# Altium schematic sheet Smart_energy_meter.SchDoc
size A3; Author: Darijo Topic dipl.ing.; DrawnBy: Darijo Topic dipl.ing.; ProjectName: Smart energy meter
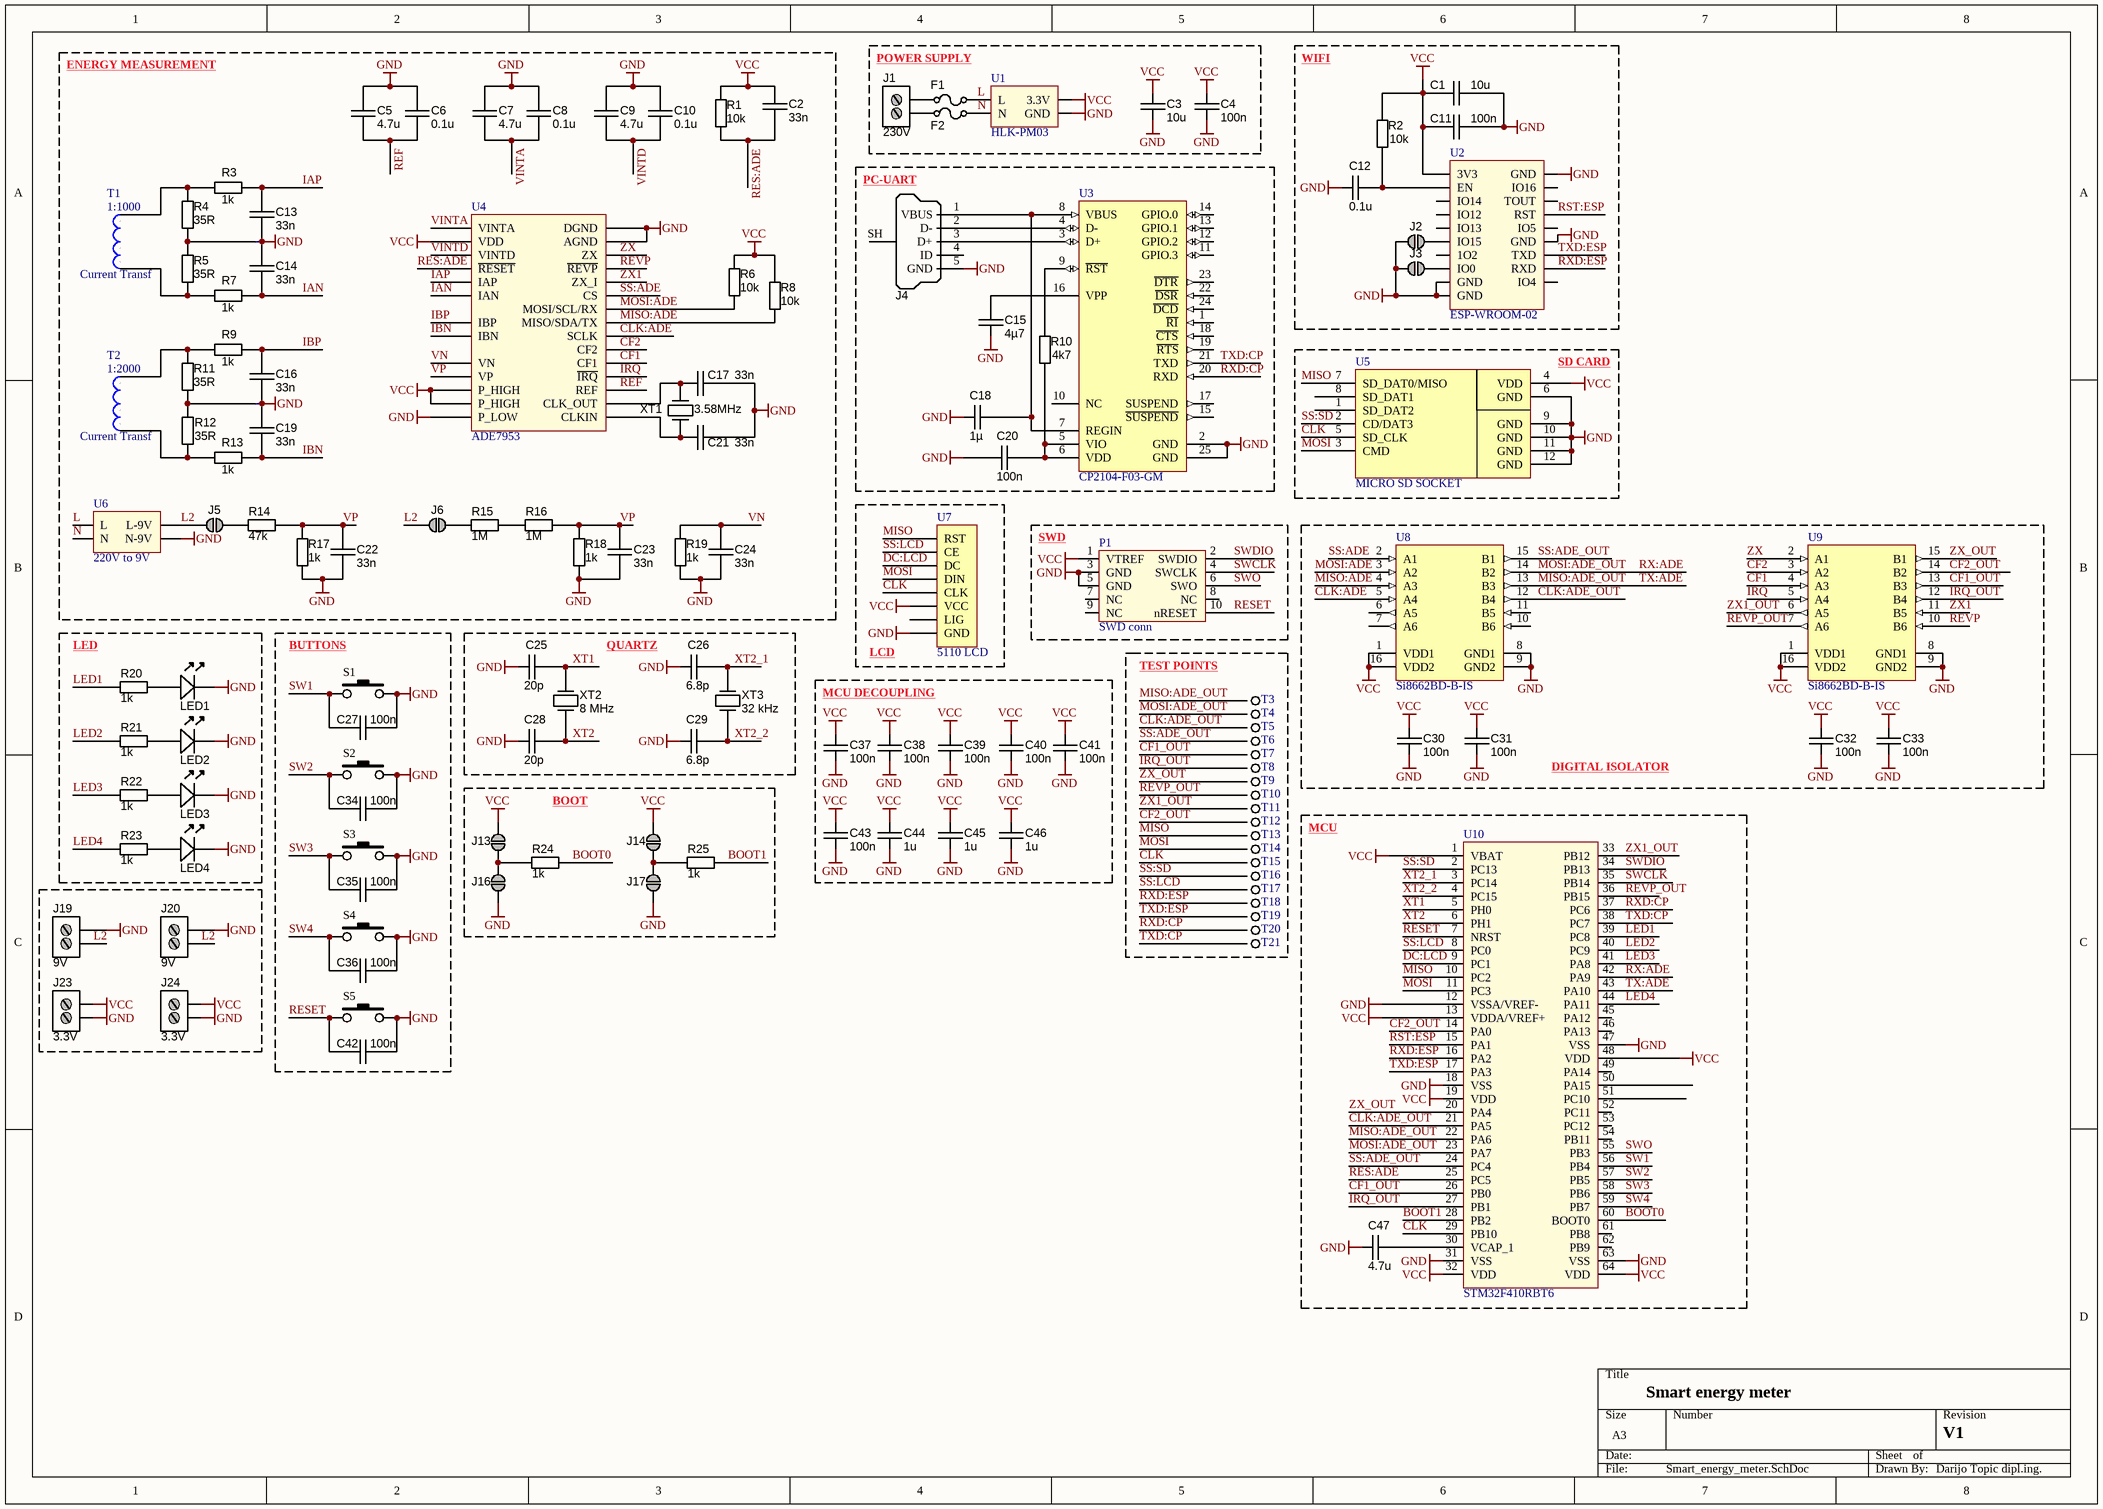
[diagram p0: Smart_energy_meter.SchDoc]

## Parts
C1  value 10u  [CAPC2012X135N]  (hidden comment: approved sub OK)
C2  value 33n  [CAPC2012X135N]  (hidden comment: approved sub OK)
C3  value 10u  [CAPC2012X135N]  (hidden comment: approved sub OK)
C4  value 100n  [CAPC2012X135N]  (hidden comment: approved sub OK)
C5  value 4.7u  [CAPC2012X135N]  (hidden comment: approved sub OK)
C6  value 0.1u  [CAPC2012X135N]  (hidden comment: approved sub OK)
C7  value 4.7u  [CAPC2012X135N]  (hidden comment: approved sub OK)
C8  value 0.1u  [CAPC2012X135N]  (hidden comment: approved sub OK)
C9  value 4.7u  [CAPC2012X135N]  (hidden comment: approved sub OK)
C10  value 0.1u  [CAPC2012X135N]  (hidden comment: approved sub OK)
C11  value 100n  [CAPC2012X135N]  (hidden comment: approved sub OK)
C12  value 0.1u  [CAPC2012X135N]  (hidden comment: approved sub OK)
C13  value 33n  [CAPC2012X135N]  (hidden comment: approved sub OK)
C14  value 33n  [CAPC2012X135N]  (hidden comment: approved sub OK)
C15  value 4µ7  [CAPC2012X135N]  (hidden comment: approved sub OK)
C16  value 33n  [CAPC2012X135N]  (hidden comment: approved sub OK)
C17  value 33n  [CAPC2012X135N]  (hidden comment: approved sub OK)
C18  value 1µ  [CAPC2012X135N]  (hidden comment: approved sub OK)
C19  value 33n  [CAPC2012X135N]  (hidden comment: approved sub OK)
C20  value 100n  [CAPC2012X135N]  (hidden comment: approved sub OK)
C21  value 33n  [CAPC2012X135N]  (hidden comment: approved sub OK)
C22  value 33n  [CAPC2012X135N]  (hidden comment: approved sub OK)
C23  value 33n  [CAPC2012X135N]  (hidden comment: approved sub OK)
C24  value 33n  [CAPC2012X135N]  (hidden comment: approved sub OK)
C25  value 20p  [CAPC2012X135N]  (hidden comment: approved sub OK)
C26  value 6.8p  [CAPC2012X135N]  (hidden comment: approved sub OK)
C27  value 100n  [CAPC2012X135N]  (hidden comment: approved sub OK)
C28  value 20p  [CAPC2012X135N]  (hidden comment: approved sub OK)
C29  value 6.8p  [CAPC2012X135N]  (hidden comment: approved sub OK)
C30  value 100n  [CAPC2012X135N]  (hidden comment: approved sub OK)
C31  value 100n  [CAPC2012X135N]  (hidden comment: approved sub OK)
C32  value 100n  [CAPC2012X135N]  (hidden comment: approved sub OK)
C33  value 100n  [CAPC2012X135N]  (hidden comment: approved sub OK)
C34  value 100n  [CAPC2012X135N]  (hidden comment: approved sub OK)
C35  value 100n  [CAPC2012X135N]  (hidden comment: approved sub OK)
C36  value 100n  [CAPC2012X135N]  (hidden comment: approved sub OK)
C37  value 100n  [CAPC2012X135N]  (hidden comment: approved sub OK)
C38  value 100n  [CAPC2012X135N]  (hidden comment: approved sub OK)
C39  value 100n  [CAPC2012X135N]  (hidden comment: approved sub OK)
C40  value 100n  [CAPC2012X135N]  (hidden comment: approved sub OK)
C41  value 100n  [CAPC2012X135N]  (hidden comment: approved sub OK)
C42  value 100n  [CAPC2012X135N]  (hidden comment: approved sub OK)
C43  value 100n  [CAPC2012X135N]  (hidden comment: approved sub OK)
C44  value 1u  [CAPC2012X135N]  (hidden comment: approved sub OK)
C45  value 1u  [CAPC2012X135N]  (hidden comment: approved sub OK)
C46  value 1u  [CAPC2012X135N]  (hidden comment: approved sub OK)
C47  value 4.7u  [CAPC2012X135N]  (hidden comment: approved sub OK)
F1  Slow-blow  [Fuses 20A 250VAC]  (value not drawn)
F2  Slow-blow  [Fuses 20A 250VAC]  (value not drawn)
J1  230V  [2P_PCB_ScrewTerm_90S_3.81MM]
J2  Jumper  [HDR1X2]  (value not drawn)  (no BOM)
J3  Jumper  [HDR1X2]  (value not drawn)  (no BOM)
J4  USB Micro Type B (recommended if hand soldering)  [USB_Micro-B_FCI_SMD]  (value not drawn)
J5  Jumper  [HDR1X2]  (value not drawn)  (no BOM)
J6  Jumper  [HDR1X2]  (value not drawn)  (no BOM)
J13  Jumper  [HDR1X2]  (value not drawn)  (no BOM)
J14  Jumper  [HDR1X2]  (value not drawn)  (no BOM)
J16  Jumper  [HDR1X2]  (value not drawn)  (no BOM)
J17  Jumper  [HDR1X2]  (value not drawn)  (no BOM)
J19  9V  [2P_PCB_ScrewTerm_90S_3.81MM]
J20  9V  [2P_PCB_ScrewTerm_90S_3.81MM]
J23  3.3V  [2P_PCB_ScrewTerm_90S_3.81MM]
J24  3.3V  [2P_PCB_ScrewTerm_90S_3.81MM]
LED1  (no value)  [LED-0805-K]
LED2  (no value)  [LED-0805-K]
LED3  (no value)  [LED-0805-K]
LED4  (no value)  [LED-0805-K]
P1  SWD conn  [HDR2X5_CEN]
R1  value 10k  [RESC2012X70N]  (hidden comment: Thick Film)
R2  value 10k  [RESC2012X70N]  (hidden comment: Thick Film)
R3  value 1k  [RESC2012X70N]  (hidden comment: Thick Film)
R4  value 35R  [RESC2012X70N]  (hidden comment: Thick Film)
R5  value 35R  [RESC2012X70N]  (hidden comment: Thick Film)
R6  value 10k  [RESC2012X70N]  (hidden comment: Thick Film)
R7  value 1k  [RESC2012X70N]  (hidden comment: Thick Film)
R8  value 10k  [RESC2012X70N]  (hidden comment: Thick Film)
R9  value 1k  [RESC2012X70N]  (hidden comment: Thick Film)
R10  value 4k7  [RESC2012X70N]  (hidden comment: Thick Film)
R11  value 35R  [RESC2012X70N]  (hidden comment: Thick Film)
R12  value 35R  [RESC2012X70N]  (hidden comment: Thick Film)
R13  value 1k  [RESC2012X70N]  (hidden comment: Thick Film)
R14  value 47k  [RESC2012X70N]  (hidden comment: Thick Film)
R15  value 1M  [RESC2012X70N]  (hidden comment: Thick Film)
R16  value 1M  [RESC2012X70N]  (hidden comment: Thick Film)
R17  value 1k  [RESC2012X70N]  (hidden comment: Thick Film)
R18  value 1k  [RESC2012X70N]  (hidden comment: Thick Film)
R19  value 1k  [RESC2012X70N]  (hidden comment: Thick Film)
R20  value 1k  [RESC2012X70N]  (hidden comment: Thick Film)
R21  value 1k  [RESC2012X70N]  (hidden comment: Thick Film)
R22  value 1k  [RESC2012X70N]  (hidden comment: Thick Film)
R23  value 1k  [RESC2012X70N]  (hidden comment: Thick Film)
R24  value 1k  [RESC2012X70N]  (hidden comment: Thick Film)
R25  value 1k  [RESC2012X70N]  (hidden comment: Thick Film)
S1  SMD_BUTTON  [SMD_BUTTON]  (value not drawn)
S2  SMD_BUTTON  [SMD_BUTTON]  (value not drawn)
S3  SMD_BUTTON  [SMD_BUTTON]  (value not drawn)
S4  SMD_BUTTON  [SMD_BUTTON]  (value not drawn)
S5  SMD_BUTTON  [SMD_BUTTON]  (value not drawn)
T1  Current Transf  RATIO: 1:1000  [CST-1025]
T2  Current Transf  RATIO: 1:2000  [DL-CT1005A]
T3  Test Point  [PIN1]  (value not drawn)
T4  Test Point  [PIN1]  (value not drawn)
T5  Test Point  [PIN1]  (value not drawn)
T6  Test Point  [PIN1]  (value not drawn)
T7  Test Point  [PIN1]  (value not drawn)
T8  Test Point  [PIN1]  (value not drawn)
T9  Test Point  [PIN1]  (value not drawn)
T10  Test Point  [PIN1]  (value not drawn)
T11  Test Point  [PIN1]  (value not drawn)
T12  Test Point  [PIN1]  (value not drawn)
T13  Test Point  [PIN1]  (value not drawn)
T14  Test Point  [PIN1]  (value not drawn)
T15  Test Point  [PIN1]  (value not drawn)
T16  Test Point  [PIN1]  (value not drawn)
T17  Test Point  [PIN1]  (value not drawn)
T18  Test Point  [PIN1]  (value not drawn)
T19  Test Point  [PIN1]  (value not drawn)
T20  Test Point  [PIN1]  (value not drawn)
T21  Test Point  [PIN1]  (value not drawn)
U1  HLK-PM03  [HLK-PM03]
U2  ESP-WROOM-02  [ESP-WROOM-02]
U3  CP2104-F03-GM  [SLAB-QFN-24-2675x2675TP_N]
U4  ADE7953  [CP_28_6]
U5  MICRO SD SOCKET  [SDSOCKET_MOLEX]
U6  220V to 9V  [TRAFO 220-9]
U7  5110 LCD  [HDR1X8]
U8  Si8662BD-B-IS  [SLAB-SOIC-16-WB_N]
U9  Si8662BD-B-IS  [SLAB-SOIC-16-WB_N]
U10  STM32F410RBT6  [STM-LQFP64_L]
XT1  3.58MHz  [CRYSTAL_HC49-US-SM]
XT2  8 MHz  [CRYSTAL_HC49-US-SM]
XT3  32 kHz  [85SMX]

## Blocks framed on the sheet
ENERGY MEASUREMENT: C2 C5-C10 C13 C14 C16 C17 C19 C21-C24 J5 J6 R1 R3-R9 R11-R19 T1 T2 U4 U6 XT1
POWER SUPPLY: C3 C4 F1 F2 J1 U1
WIFI: C1 C11 C12 J2 J3 R2 U2
PC-UART: C15 C18 C20 J4 R10 U3
SD CARD: U5
LCD: U7
SWD: P1
DIGITAL ISOLATOR: C30-C33 U8 U9
LED: LED1-LED4 R20-R23
BUTTONS: C27 C34-C36 C42 S1-S5
QUARTZ: C25 C26 C28 C29 XT2 XT3
TEST POINTS: T3-T21
MCU DECOUPLING: C37-C41 C43-C46
BOOT: J13 J14 J16 J17 R24 R25
MCU: C47 U10

## Nets
GND: C1.1 C3.2 C4.2 C5.2 C6.2 C7.2 C8.2 C9.2 C10.2 C11.1 C12.2 C13.1 C14.2 C15.2 C16.1 C17.1 C18.1 C19.2 C20.1 C21.1 C22.1 C23.1 C24.1 C25.2 C26.2 C27.2 C28.2 C29.2 C30.2 C31.2 C32.2 C33.2 C34.2 C35.2 C36.2 C37.2 C38.2 C39.2 C40.2 C41.2 C42.2 C43.2 C44.2 C45.2 C46.2 C47.1 J2.2 J3.2 J4.5(GND) J16.2 J17.2 J19.1 J20.1 J23.2 J24.2 LED1.K LED2.K LED3.K LED4.K P1.3(GND) P1.5(GND) R4.2 R5.1 R11.2 R12.1 R17.2 R18.2 R19.2 S1.2 S2.2 S3.2 S4.2 S5.2 U1.3(GND) U2.9(GND) U2.10(GND) U2.15(GND) U2.19(GND) U3.2(GND) U3.25(GND) U4.4(DGND) U4.14(P_LOW) U4.16(AGND) U5.6(GND) U5.9(GND) U5.10(GND) U5.11(GND) U5.12(GND) U6.4(N-9V) U7.8(GND) U8.8(GND1) U8.9(GND2) U9.8(GND1) U9.9(GND2) U10.12(VSSA/VREF-) U10.18(VSS) U10.31(VSS) U10.47(VSS) U10.63(VSS)
VCC: C1.2 C2.2 C3.1 C4.1 C11.2 C30.1 C31.1 C32.1 C33.1 C37.1 C38.1 C39.1 C40.1 C41.1 C43.1 C44.1 C45.1 C46.1 J13.1 J14.1 J23.1 J24.1 P1.1(VTREF) R1.1 R2.2 R6.1 R8.1 U1.4(3.3V) U2.1(3V3) U4.7(P_HIGH) U4.8(P_HIGH) U4.17(VDD) U5.4(VDD) U7.6(VCC) U8.1(VDD1) U8.16(VDD2) U9.1(VDD1) U9.16(VDD2) U10.1(VBAT) U10.13(VDDA/VREF+) U10.19(VDD) U10.32(VDD) U10.48(VDD) U10.64(VDD)
BOOT0: R24.2 U10.60(BOOT0)
BOOT1: R25.2 U10.28(PB2)
CF1: U4.23(CF1) U9.4(A3)
CF1_OUT: T7.1 U9.13(B3) U10.26(PB0)
CF2: U4.24(CF2) U9.3(A2)
CF2_OUT: T12.1 U9.14(B2) U10.14(PA0)
CLK: T15.1 U5.5(SD_CLK) U7.5(CLK) U10.29(PB10)
CLK:ADE: U4.25(SCLK) U8.5(A4)
CLK:ADE_OUT: T5.1 U8.12(B4) U10.21(PA5)
DC:LCD: U7.3(DC) U10.9(PC1)
IAN: C14.1 R7.2 U4.6(IAN)
IAP: C13.2 R3.2 U4.5(IAP)
IBN: C19.1 R13.2 U4.10(IBN)
IBP: C16.2 R9.2 U4.9(IBP)
IRQ: U4.22(~{IRQ}) U9.5(A4)
IRQ_OUT: T8.1 U9.12(B4) U10.27(PB1)
L: F1.2 U1.1(L) U6.1(L)
L2: J5.2 J6.2 J19.2 J20.2 U6.3(L-9V)
LED1: R20.1 U10.39(PC8)
LED2: R21.1 U10.40(PC9)
LED3: R22.1 U10.41(PA8)
LED4: R23.1 U10.44(PA11)
MISO: T13.1 U5.7(SD_DAT0/MISO) U7.1(RST) U10.10(PC2)
MISO:ADE: R8.2 U4.26(MISO/SDA/TX) U8.4(A3)
MISO:ADE_OUT: T3.1 U8.13(B3) U10.22(PA6) U10.43(PA10)  [also labelled TX:ADE]
MOSI: T14.1 U5.3(CMD) U7.4(DIN) U10.11(PC3)
MOSI:ADE: R6.2 U4.27(MOSI/SCL/RX) U8.3(A2)
MOSI:ADE_OUT: T4.1 U8.14(B2) U10.23(PA7) U10.42(PA9)  [also labelled RX:ADE]
N: F2.2 U1.2(N) U6.2(N)
REF: C5.1 C6.1 U4.13(REF)
RES:ADE: C2.1 R1.2 U4.2(~{RESET}) U10.25(PC5)
RESET: C42.1 P1.10(nRESET) S5.1 U10.7(NRST)
REVP: U4.20(~{REVP}) U9.10(B6)
REVP_OUT: T10.1 U9.7(A6) U10.36(PB15)
RST:ESP: U2.13(RST) U10.15(PA1)
RXD:CP: T20.1 U3.20(RXD) U10.37(PC6)
RXD:ESP: T18.1 U2.17(RXD) U10.16(PA2)
SS:ADE: U4.28(CS) U8.2(A1)
SS:ADE_OUT: T6.1 U8.15(B1) U10.24(PC4)
SS:LCD: T17.1 U7.2(CE) U10.8(PC0)
SS:SD: T16.1 U5.2(CD/DAT3) U10.2(PC13)
SW1: C27.1 S1.1 U10.56(PB4)
SW2: C34.1 S2.1 U10.57(PB5)
SW3: C35.1 S3.1 U10.58(PB6)
SW4: C36.1 S4.1 U10.59(PB7)
SWCLK: P1.4(SWCLK) U10.35(PB14)
SWDIO: P1.2(SWDIO) U10.34(PB13)
SWO: P1.6(SWO) U10.55(PB3)
TXD:CP: T21.1 U3.21(TXD) U10.38(PC7)
TXD:ESP: T19.1 U2.16(TXD) U10.17(PA3)
VINTA: C7.1 C8.1 U4.15(VINTA)
VINTD: C9.1 C10.1 U4.3(VINTD)
VN: C24.2 R19.1 U4.11(VN)
VP: C22.2 C23.2 R14.2 R16.1 R17.1 R18.1 U4.12(VP)
XT1: C25.1 U10.5(PH0) XT2.2(OUT)
XT2: C28.1 U10.6(PH1) XT2.1(IN)
XT2_1: C26.1 U10.3(PC14) XT3.2(OUT)
XT2_2: C29.1 U10.4(PC15) XT3.1(IN)
ZX: U4.1(ZX) U9.2(A1)
ZX1: U4.21(ZX_I) U9.11(B5)
ZX1_OUT: T11.1 U9.6(A5) U10.33(PB12)
ZX_OUT: T9.1 U9.15(B1) U10.20(PA4)
NetC12_1: C12.1 R2.1 U2.2(EN)
NetC15_1: C15.1 U3.16(VPP)
NetC17_2: C17.2 U4.19(CLK_OUT) XT1.2(OUT)
NetC18_2: C18.2 J4.1(VBUS) U3.7(REGIN) U3.8(VBUS)
NetC20_2: C20.2 R10.1 U3.5(VIO) U3.6(VDD)
NetC21_2: C21.2 U4.18(CLKIN) XT1.1(IN)
NetC47_2: C47.2 U10.30(VCAP_1)
NetF1_1: F1.1 J1.1
NetF2_1: F2.1 J1.2
NetJ2_1: J2.1 U2.6(IO15)
NetJ3_1: J3.1 U2.8(IO0)
NetJ4_2: J4.2(D-) U3.4(D-)
NetJ4_3: J4.3(D+) U3.3(D+)
NetJ5_1: J5.1 R14.1
NetJ6_1: J6.1 R15.2
NetJ13_2: J13.2 J16.1 R24.1
NetJ14_2: J14.2 J17.1 R25.1
NetLED1_A: LED1.A R20.2
NetLED2_A: LED2.A R21.2
NetLED3_A: LED3.A R22.2
NetLED4_A: LED4.A R23.2
NetR3_1: R3.1 R4.1 T1.1
NetR5_2: R5.2 R7.1 T1.2
NetR9_1: R9.1 R11.1 T2.1
NetR10_2: R10.2 U3.9(~{RST})
NetR12_2: R12.2 R13.1 T2.2
NetR15_1: R15.1 R16.2

Not connected (* = marked no-connect by the designer): J4 4(ID) SH(Shell); P1 7(NC) 8(NC) 9(NC); U2 3(IO14) 4(IO12) 5(IO13) 7(1O2) 11(IO16) 12(TOUT) 14(IO5) 18(IO4); U3 1(~{RI}) 10(NC) 11(GPIO.3) 12(GPIO.2) 13(GPIO.1) 14(GPIO.0) 15(~{SUSPEND}) 17(SUSPEND) 18(~{CTS}) 19(~{RTS}) 22(~{DSR}) 23(~{DTR}) 24(~{DCD}); U5 1(SD_DAT2) 8(SD_DAT1); U7 7(LIG); U8 6(A5) 7(A6) 10(B6) 11(B5); U10 45(PA12) 46(PA13) 49(PA14) 50(PA15) 51(PC10) 52(PC11) 53(PC12) 54(PB11) 61(PB8) 62(PB9)

## Notes on the sheet
- Smart energy meter
- V1

## Library data of the parts
C1-C14 C16 C17 C19-C47 = CAPC_100n_0805_X7R_50V_10%: Capacitor SMD Cer 100nF 10% 50V X7R 0805; Manufacturer 1: Kemet; Manufacturer Part Number 1: C0805C104K5RACTU; Ratings: 50V; X7R; Material: ceramic; SCDType: undef; Package / Case: 0805 (2012 metric); Tolerance: ±10%; Supplier 1: Digi-Key; Supplier Part Number 1: 399-1170-1-ND
C15 = CAPC_4u7_0805: Capacitor SMD Cer 4.7uF 10% 16V X5R 0805; Manufacturer 1: Taiyo Yuden; Manufacturer Part Number 1: EMK212BJ475KG-T; Ratings: 16V; X5R; Material: ceramic; SCDType: spec; Package / Case: 0805 (2012 Metric); Tolerance: ±10%; Supplier 1: Digi-Key; Supplier Part Number 1: 587-1294-1-ND; Operating Temperature: -55°C ~ 85°C; Size / Dimension: 0.079" L x 0.049" W (2.00mm x 1.25mm); Thickness (Max): 0.053" (1.35mm); ComponentLink1URL: http://www.yuden.co.jp/productdata/catalog/en/mlcc01_e.pdf; ComponentLink1Description: http://www.yuden.co.jp/productdata/catalog/en/mlcc01_e.pdf; Supplier 2: Digi-Key; Supplier Part Number 2: 1276-1065-1-ND; Manufacturer 2: Samsung Electro-Mechanics America, Inc; Manufacturer Part Number 2: CL21A475KOFNNNE; RoHS 2: RoHS Compliant; ComponentLink2URL: http://www.samsungsem.com/servlet/FileDownload?type=spec&file=CL21A475KOFNNNE.pdf; ComponentLink2Description: http://www.samsungsem.com/servlet/FileDownload?type=spec&file=CL21A475KOFNNNE.pdf; Supplier 3: Digi-Key; Supplier Part Number 3: 399-8101-1-ND; Manufacturer 3: Kemet; Manufacturer Part Number 3: C0805C475K4PACTU; RoHS 3: RoHS Compliant; ComponentLink3URL: http://capacitoredge.kemet.com/capedge2/DataSheet?pn=C0805C475K4PACTU; ComponentLink3Description: http://capacitoredge.kemet.com/capedge2/DataSheet?pn=C0805C475K4PACTU; Supplier 4: Digi-Key; Supplier Part Number 4: 490-7215-1-ND; Manufacturer 4: Murata Electronics North America; Manufacturer Part Number 4: GRM21BR61C475MA88L; RoHS 4: RoHS Compliant; ComponentLink4URL: http://psearch.murata.com/capacitor/product/GRM21BR61C475MA88#.pdf; ComponentLink4Description: http://psearch.murata.com/capacitor/product/GRM21BR61C475MA88#.pdf; Supplier 5: Digi-Key; Supplier Part Number 5: 445-7640-1-ND; Manufacturer 5: TDK Corporation; Manufacturer Part Number 5: C2012X5R1C475K125AC; RoHS 5: RoHS Compliant; ComponentLink5URL: http://product.tdk.com/capacitor/mlcc/en/documents/mlcc_commercial_general_en.pdf; ComponentLink5Description: http://product.tdk.com/capacitor/mlcc/en/documents/mlcc_commercial_general_en.pdf; RoHS 1: RoHS Compliant
C18 = CAPC_1u_0805_X7R_16V_10%: Capacitor SMD Cer 1uF 10% 16V X7R 0805; Manufacturer 1: Yageo; Manufacturer Part Number 1: CC0805KKX7R7BB105; Ratings: 16V; X7R; Material: ceramic; SCDType: spec; Package / Case: 0805 (2012 metric); Tolerance: ±10%; Supplier 1: Digi-Key; Supplier Part Number 1: 311-1365-6-ND; RoHS 1: RoHS Compliant; Temperature Coefficient: X7R; ComponentLink1URL: http://www.yageo.com/documents/recent/UPY-GPHC_X7R_6.3V-to-50V_8.pdf; ComponentLink1Description: http://www.yageo.com/documents/recent/UPY-GPHC_X7R_6.3V-to-50V_8.pdf; Supplier 2: Digi-Key; Supplier Part Number 2: 399-1284-6-ND; Manufacturer 2: Kemet; Manufacturer Part Number 2: C0805C105K4RACTU; RoHS 2: RoHS Compliant; ComponentLink2URL: http://www.kemet.com/datasheets&C0805C105K4RACTU; ComponentLink2Description: http://www.kemet.com/datasheets&C0805C105K4RACTU; Supplier 3: Digi-Key; Supplier Part Number 3: 1276-1026-6-ND; Manufacturer 3: Samsung Electro-Mechanics America, Inc; Manufacturer Part Number 3: CL21B105KOFNNNE; RoHS 3: RoHS Compliant; ComponentLink3URL: http://www.samsungsem.com/servlet/FileDownload?type=spec&file=CL21B105KOFNNNE.pdf; ComponentLink3Description: http://www.samsungsem.com/servlet/FileDownload?type=spec&file=CL21B105KOFNNNE.pdf; Supplier 4: Digi-Key; Supplier Part Number 4: 445-1358-6-ND; Manufacturer 4: TDK Corporation; Manufacturer Part Number 4: C2012X7R1C105K125AA; RoHS 4: RoHS Compliant; ComponentLink4URL: http://product.tdk.com/capacitor/mlcc/en/documents/mlcc_commercial_general_en.pdf; ComponentLink4Description: http://product.tdk.com/capacitor/mlcc/en/documents/mlcc_commercial_general_en.pdf
F1 F2 = FUSE_160mA_0603: Fuse 160mA 63VDC 0603 SMD; Manufacturer 1: Holly Fuse; Manufacturer Part Number 1: 06T-0160L; Ratings: 160mA; 63VDC; slow-blow; SCDType: spec; Package / Case: 0603 (1608 metric); Value: 160mA
J1 J19 J20 J23 J24 = 2P_ScrewTerm_90S_3.81MM: Terminal Block Screw Type THT 2-Position 3.81mm pitch; Manufacturer 1: Tyco Electronics; Manufacturer Part Number 1: 1776113-2; Value: 2 position; Pitch: 0.150" (3.81mm); Positions Per Level: 2; SCDType: undef; Package / Case: Side Entry; 3.81mm pitch; Category: Connectors Interconnects; Color: Black; Supplier 1: Digi-Key; Supplier Part Number 1: A97976-ND
J2 J3 J5 J6 J13 J14 J16 J17 = JUMP1: SMD jumper
J4 = USB_Micro_TypeB_FCI: Connector SMD-THD USB Micro Type B middle mount; Manufacturer 1: FCI; Manufacturer Part Number 1: 10103593-0001LF; SCDType: undef; Package / Case: SMD/THD mid-mount; Supplier 1: Digi-Key; Supplier Part Number 1: 609-4049-1-ND; Mouser: 649-10103593-0001LF
LED1-LED4 = LED_SMD_Green_0805_6mcd: LED, 0805 SMD, Green; Manufacturer 1: LITE-ON; Manufacturer Part Number 1: LTST-C171GKT; Material: GaP; Ratings: 6 mcd; 569 nm; SCDType: source; Package / Case: 0805; Supplier 1: Digi-Key; Supplier Part Number 1: 160-1423-1-ND; Value: Green; Color: Green
P1 = SW_debug: SWD connector
R1-R25 = RES_4K7_0805_1%: Resistor SMD chip 4.7k Ohm 0.125W 1% 0805; Manufacturer 1: Vishay/Dale; Manufacturer Part Number 1: CRCW08054K70FKEA; Ratings: 1/8W; SCDType: spec; Package / Case: 0805 (2012 metric); Supplier 1: Digi-Key; Supplier Part Number 1: 541-4.70KCCT-ND; Tolerance: ±1%
T1 T2 = Transf_Current: Current Transformer
T3-T21 = Test_Point
U1 = HLK-PM03: AC 220V to DC 3.3V
U2 = ESP-WROOM-02: WIFI module
U3 = CP2104-F03-GM: Single-Chip USB to UART Bridge, 4 Dig I/O Pins, Internal Oscillator, 1024 Bytes EEPROM, -40 to 85 degC, 24-pin QFN; Manufacturer: Silicon Labs; Internal Oscillator: TRUE; Sub-Family: USB Bridges; DatasheetVersion: Rev. 1.0; PackageReference: QFN-24; PackageDescription: 24-Pin Quad-Flat No-Leads Package, Body 4 x 4 mm, Pitch 0.5 mm; Supplier 1: Digi-Key; Supplier Part Number 1: 336-2008-5-ND; Supplier 2: Mouser; Supplier Part Number 2: 634-CP2104-F03-GM; EEPROM: 1024 Bytes; Mounting Technology: Surface Mount; Code_JEDEC: MO-220; Code_IPC: J-STD-020; PartNumber: CP2104-F03-GM; ComponentLink1Description: Manufacturer URL; ComponentLink1URL: http://www.silabs.com/; ComponentLink2Description: Datasheet; ComponentLink2URL: http://www.silabs.com/Support%20Documents/TechnicalDocs/cp2104.pdf; ComponentLink3Description: Package Specification; ComponentLink3URL: http://www.silabs.com/Support%20Documents/TechnicalDocs/C8051F93x-92x.pdf; Mouser: 634-CP2104-F03-GM
U4 = ADE7953: Energy meter
U5 = MICRO_SD_MOLEX: uSD SOCKET; Manufacturer: Molex; Item #:: 47219-2001
U6 = TRANSFOR 220V-9V: BV EI 304 2041
U7 = Header 8: Header, 8-Pin; LatestRevisionDate: 17-Jul-2002; LatestRevisionNote: Re-released for DXP Platform.; Publisher: Altium Limited
U8 U9 = Si8662BD-B-IS: Low Power Six-Channel Digital Isolator, 150 Mbps, 5 kVRMS Isolation Rating, -40 to 125 degC, 16-pin SOIC; Manufacturer: Silicon Labs; 10kV surge: FALSE; Channel Type: Unidirectional; Isolation Rating (kV): 5; Maximum Data Rate (Mbps): 150; Maximum Propagation Delay (ns): 13; Sub-Family: Isolators; DatasheetVersion: Rev. 1.4; PackageReference: SOIC-16-WB; PackageDescription: 16-Pin Wide Body Plastic Small Outline, Body 10.3 x 7.5 mm, Pitch 1.27 mm; Supplier 1: Digi-Key; Supplier Part Number 1: 336-2125-5-ND; Supplier 2: Mouser; Supplier Part Number 2: 634-SI8662BD-B-IS; AEC-Q100: FALSE; Enable Control: FALSE; Mounting Technology: Surface Mount; Code_JEDEC: MS-013; PartNumber: Si8662BD-B-IS; ComponentLink1Description: Manufacturer URL; ComponentLink1URL: http://www.silabs.com/; ComponentLink2Description: Datasheet; ComponentLink2URL: http://www.silabs.com/Support%20Documents/TechnicalDocs/Si866x.pdf; ComponentLink3Description: Package Specification; ComponentLink3URL: https://www.silabs.com/Support%20Documents/TechnicalDocs/Si823x.pdf
U10 = STM32F410CB: STM32 Cortex M4 - F4 series
XT1-XT3 = Crystal_6MHz_HC49/US: Resonator Ceramic 6.00 MHz 30ppm; Manufacturer 1: CTS-Frequency Controls; Manufacturer Part Number 1: ATS060BSM-1; Frequency: 6MHz; Frequency Stability: ±50ppm; Load Capacitance: 18pF; Operating Mode: Fundamental; Parameter Name: 0.169" (4.30mm); SCDType: spec; Package / Case: HC49/US-SM; Ratings: 6.00 MHz; Supplier 1: Digi-Key; Supplier Part Number 1: CTX882CT-ND; Type: MHz Crystal; Frequency Tolerance: ±30ppm; Operating Temperature: -20°C ~ 70°C; Mounting Type: Surface Mount; Size / Dimension: 0.437" L x 0.190" W (11.10mm x 4.83mm); ComponentLink1URL: http://www.ctscorp.com/components/Datasheets/008-0309-0.pdf; ComponentLink1Description: http://www.ctscorp.com/components/Datasheets/008-0309-0.pdf